# Altium project Modular Parent Motherboard.PrjPcb
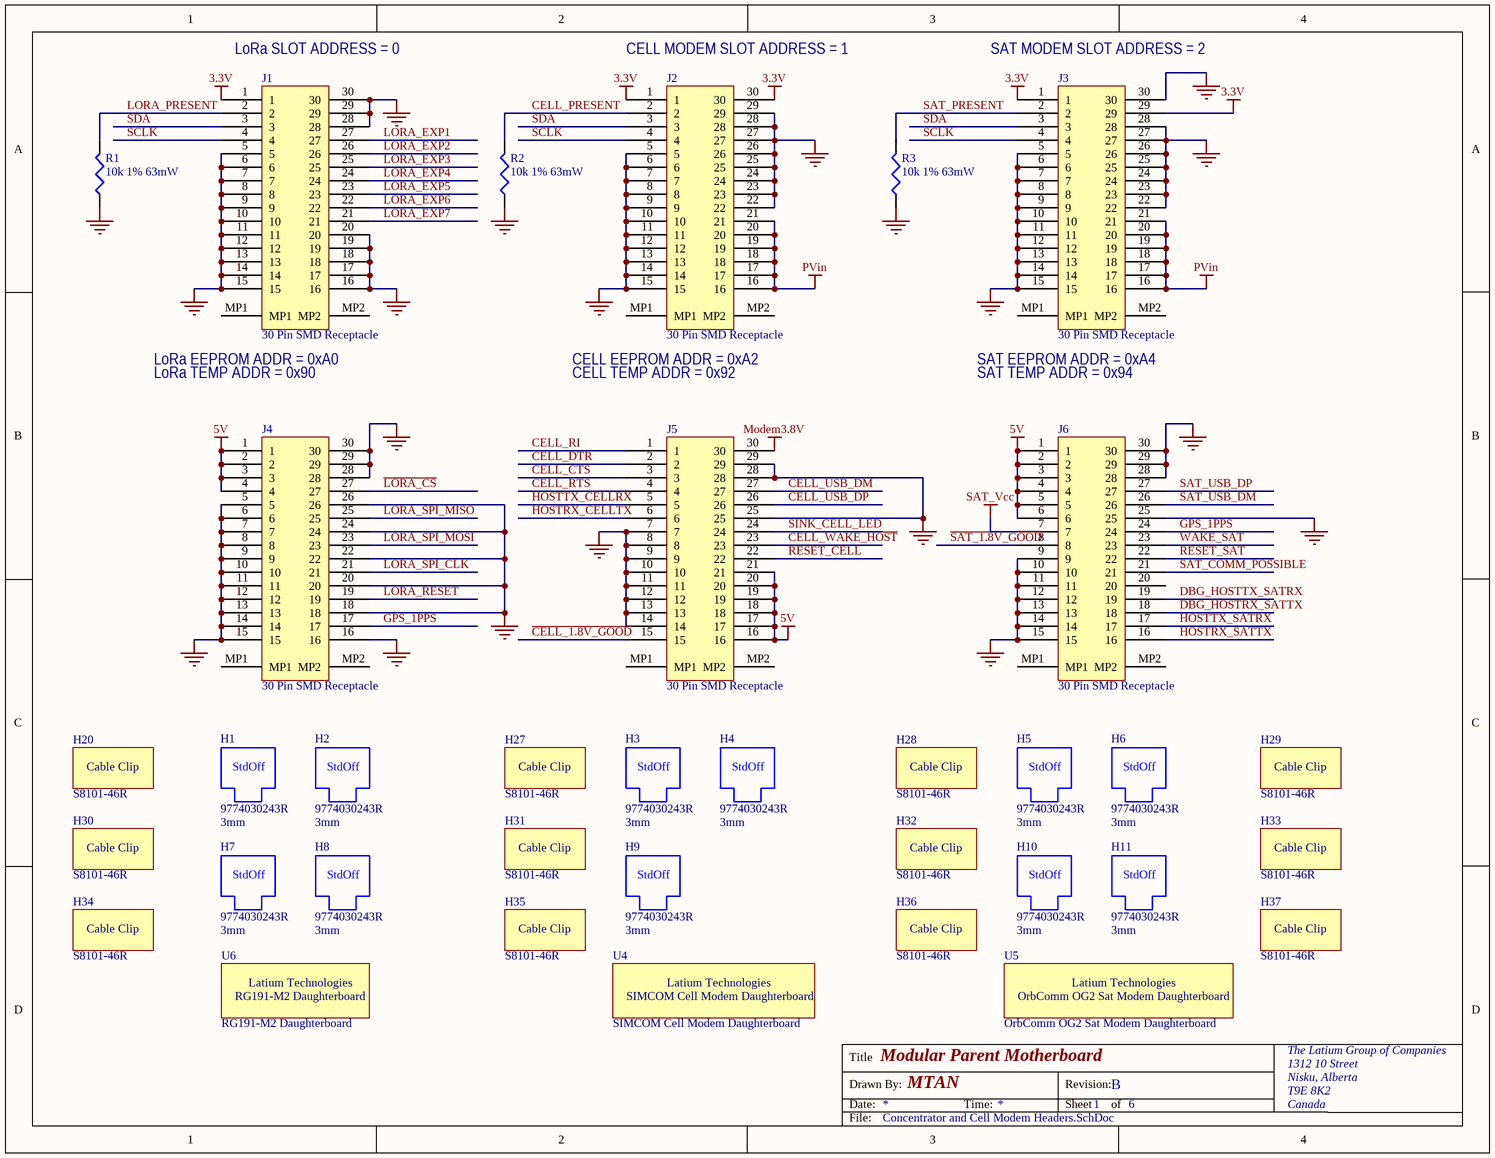
[diagram p0: Concentrator and Cell Modem Headers.SchDoc]
6 sheets, 150 parts. Net scope: global (net labels, ports and power ports of the same name join across sheets).
Board file: Modular Parent Motherboard.PcbDoc
Sheets:
  Concentrator and Cell Modem Headers.SchDoc
  Expansion Headers.SchDoc
  Slot Pullups and Pulldowns.SchDoc
  Power Supply and LEDs.SchDoc
  Controller Headers.SchDoc
  Controller Watchdog.SchDoc

## Sheet Concentrator and Cell Modem Headers.SchDoc: Modular Parent Motherboard
size Letter; DrawnBy: MTAN; Organization: Altium Limited; DocumentNumber: 1; Revision: B; SheetNumber: 1; SheetTotal: 6

### Parts
H1  9774030243R  Height: 3mm  [Wurth 9774030243R]
H2  9774030243R  Height: 3mm  [Wurth 9774030243R]
H3  9774030243R  Height: 3mm  [Wurth 9774030243R]
H4  9774030243R  Height: 3mm  [Wurth 9774030243R]
H5  9774030243R  Height: 3mm  [Wurth 9774030243R]
H6  9774030243R  Height: 3mm  [Wurth 9774030243R]
H7  9774030243R  Height: 3mm  [Wurth 9774030243R]
H8  9774030243R  Height: 3mm  [Wurth 9774030243R]
H9  9774030243R  Height: 3mm  [Wurth 9774030243R]
H10  9774030243R  Height: 3mm  [Wurth 9774030243R]
H11  9774030243R  Height: 3mm  [Wurth 9774030243R]
H20  S8101-46R  [Coax Cable Clip]
H27  S8101-46R  [Coax Cable Clip]
H28  S8101-46R  [Coax Cable Clip]
H29  S8101-46R  [Coax Cable Clip]
H30  S8101-46R  [Coax Cable Clip]
H31  S8101-46R  [Coax Cable Clip]
H32  S8101-46R  [Coax Cable Clip]
H33  S8101-46R  [Coax Cable Clip]
H34  S8101-46R  [Coax Cable Clip]
H35  S8101-46R  [Coax Cable Clip]
H36  S8101-46R  [Coax Cable Clip]
H37  S8101-46R  [Coax Cable Clip]
J1  30 Pin SMD Receptacle  [10132798-031100LF]
J2  30 Pin SMD Receptacle  [10132798-031100LF]
J3  30 Pin SMD Receptacle  [10132798-031100LF]
J4  30 Pin SMD Receptacle  [10132798-031100LF]
J5  30 Pin SMD Receptacle  [10132798-031100LF]
J6  30 Pin SMD Receptacle  [10132798-031100LF]
R1  10k 1% 63mW  [RESC1005L]
R2  10k 1% 63mW  [RESC1005L]
R3  10k 1% 63mW  [RESC1005L]
U4  SIMCOM Cell Modem Daughterboard  [SIMCOM Cell Modem Daughterboard]  (no BOM)
U5  OrbComm OG2 Sat Modem Daughterboard  [OrbComm OG2 Daughterboard]  (no BOM)
U6  RG191-M2 Daughterboard  [RG191-M2 LoRa Daughterboard]  (no BOM)

### Nets
3.3V: J1.1 J2.1 J2.30 J3.1 J3.29
5V: J4.1 J4.2 J4.3 J4.4 J5.16 J5.17 J5.18 J5.19 J5.20 J5.21 J6.1 J6.2 J6.3 J6.4 J6.5 J6.6
GND: J1.5 J1.6 J1.7 J1.8 J1.9 J1.10 J1.11 J1.12 J1.13 J1.14 J1.15 J1.16 J1.17 J1.18 J1.19 J1.20 J1.28 J1.29 J1.30 J2.5 J2.6 J2.7 J2.8 J2.9 J2.10 J2.11 J2.12 J2.13 J2.14 J2.15 J2.22 J2.23 J2.24 J2.25 J2.26 J2.27 J2.28 J2.29 J3.5 J3.6 J3.7 J3.8 J3.9 J3.10 J3.11 J3.12 J3.13 J3.14 J3.15 J3.22 J3.23 J3.24 J3.25 J3.26 J3.27 J3.28 J3.30 J4.5 J4.6 J4.7 J4.8 J4.9 J4.10 J4.11 J4.12 J4.13 J4.14 J4.15 J4.16 J4.18 J4.20 J4.22 J4.24 J4.26 J4.28 J4.29 J4.30 J5.7 J5.8 J5.9 J5.10 J5.11 J5.12 J5.13 J5.14 J5.25 J5.28 J5.29 J6.9 J6.10 J6.11 J6.12 J6.13 J6.14 J6.15 J6.25 J6.28 J6.29 J6.30 R1.1 R2.1 R3.1
Modem3.8V: J5.30
PVin: J2.16 J2.17 J2.18 J2.19 J2.20 J2.21 J3.16 J3.17 J3.18 J3.19 J3.20 J3.21
SAT_Vcc: J6.7
~{CELL_1.8V_GOOD}: J5.15
~{CELL_WAKE_HOST}: J5.23
CELL_CTS: J5.3
CELL_DTR: J5.2
CELL_PRESENT: J2.2 R2.2
CELL_RI: J5.1
CELL_RTS: J5.4
CELL_USB_DM: J5.27
CELL_USB_DP: J5.26
DBG_HOSTRX_SATTX: J6.18
DBG_HOSTTX_SATRX: J6.19
GPS_1PPS: J4.17 J6.24
HOSTRX_CELLTX: J5.6
HOSTRX_SATTX: J6.16
HOSTTX_CELLRX: J5.5
HOSTTX_SATRX: J6.17
~{LORA_CS}: J4.27
LORA_EXP1: J1.27
LORA_EXP2: J1.26
LORA_EXP3: J1.25
LORA_EXP4: J1.24
LORA_EXP5: J1.23
LORA_EXP6: J1.22
LORA_EXP7: J1.21
LORA_PRESENT: J1.2 R1.2
LORA_RESET: J4.19
LORA_SPI_CLK: J4.21
LORA_SPI_MISO: J4.25
LORA_SPI_MOSI: J4.23
RESET_CELL: J5.22
RESET_SAT: J6.22
~{SAT_1.8V_GOOD}: J6.8
~{SINK_CELL_LED}: J5.24
SAT_COMM_POSSIBLE: J6.21
SAT_PRESENT: J3.2 R3.2
SAT_USB_DM: J6.26
SAT_USB_DP: J6.27
SCLK: J1.4 J2.4 J3.4
SDA: J1.3 J2.3 J3.3
WAKE_SAT: J6.23

Not connected (* = marked no-connect by the designer): J1 MP1 MP2; J2 MP1 MP2; J3 MP1 MP2; J4 MP1 MP2; J5 MP1 MP2; J6 20 MP1 MP2

### Notes on the sheet
- (near J1) LoRa SLOT ADDRESS = 0
- (near J2) CELL MODEM SLOT ADDRESS = 1
- (near J3) SAT MODEM SLOT ADDRESS = 2
- (near J1) LoRa EEPROM ADDR = 0xA0
- (near J2) CELL EEPROM ADDR = 0xA2
- (near J3) SAT EEPROM ADDR = 0xA4
- LoRa TEMP ADDR = 0x90
- CELL TEMP ADDR = 0x92
- SAT TEMP ADDR = 0x94
- Title
- Drawn By:
- Date:
- Time:
- Revision:
- Sheet
- of
- The Latium Group of Companies
- 1312 10 Street
- Nisku, Alberta
- T9E 8K2
- Canada
- File:
- (in symbol OrbComm OG2 Sat Modem Daughterboard) Latium Technologies
- (in symbol RG191-M2 Daughterboard) Latium Technologies
- (in symbol SIMCOM Cell Modem Daughterboard) Latium Technologies
- (in symbol SMD M3 Spacer) StdOff

### Library data of the parts
H1-H11 = SMD M3 Spacer: ROUND STANDOFF M2X0.4 STEEL 3MM; Manufacturer: Wurth Electronics Inc; Supplier 1: Digi-Key; Value: 9774030243R; Manufacturer Part Number: 9774030243R; ComponentLink1Description: Drawing; ComponentLink1URL: S:\Hardware\Data Sheets\Passive\Standoffs\Wurth 9774070360R.pdf; Supplier 1 Part Number: 732-7085-1-ND
H20 H27-H37 = Cable Clip: CBL CLIP C-TYPE SILVER SOLDER; Manufacturer: Harwin Inc; Value: S8101-46R; ComponentLink1Description: Drawing; ComponentLink1URL: S:\Hardware\Data Sheets\Passive\Strain Reliefs\S8101R.pdf; Manufacturer Part Number: S8101-46R; Supplier 1: Digi-Key; Supplier 1 Part Number: 952-1576-1-ND
J1-J6 = Amphenol 30 Pos BergStak Plug: CONN RCPT 30POS SMD GOLD; Manufacturer: Amphenol ICC (FCI); Note: Mates with 10132797-031100LF plug 3mm between board height; Value: 30 Pin SMD Receptacle; Manufacturer Part Number: 10132798-031100LF; Supplier 1: Digi-Key; Supplier 1 Part Number: 609-5030-1-ND
R1-R3 = Res3: Resistor; Value: 10k 1% 63mW
U4 = SIMCOM Cell Modem Daughterboard: Value: SIMCOM Cell Modem Daughterboard
U5 = OrbComm OG2 Sat Modem Daughterboard: Value: OrbComm OG2 Sat Modem Daughterboard
U6 = RG191-M2 Daughterboard: Value: RG191-M2 Daughterboard

## Sheet Expansion Headers.SchDoc: Modular Parent Motherboard
size Letter; DrawnBy: MTAN; Organization: Altium Limited; DocumentNumber: 2; Revision: B; SheetNumber: 2; SheetTotal: 6
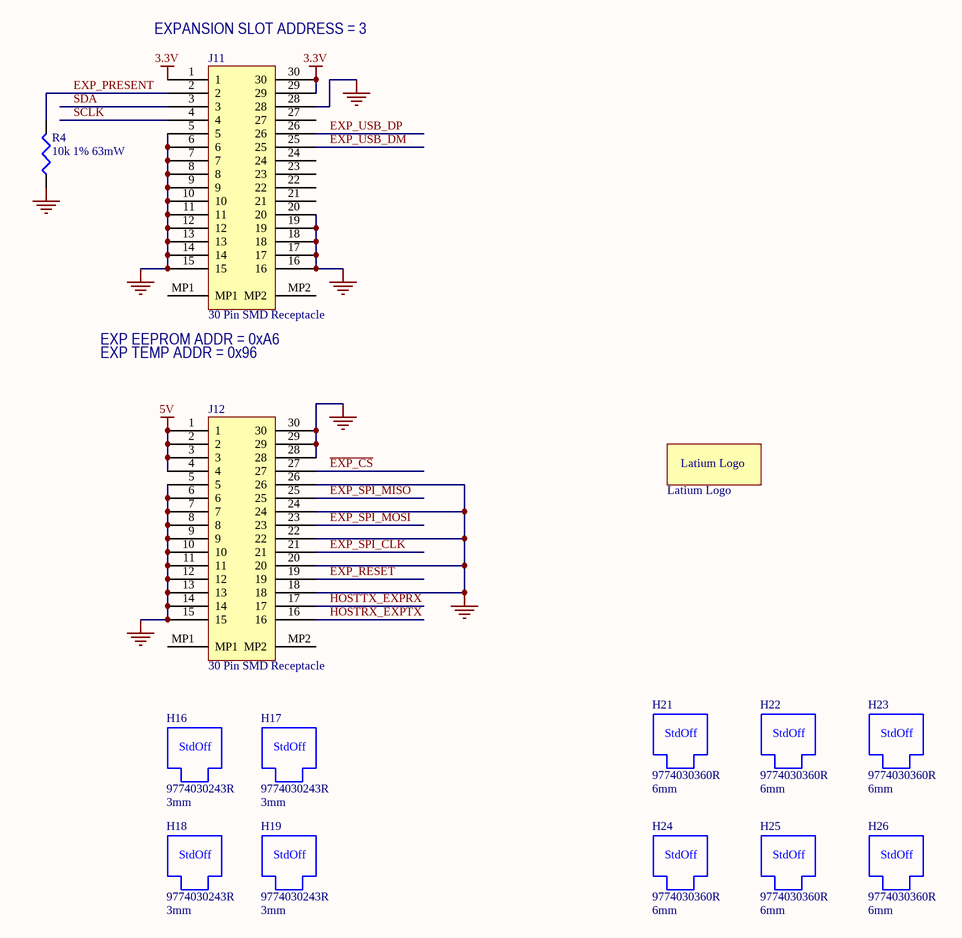
[diagram p1: Expansion Headers.SchDoc]

### Parts
H16  9774030243R  Height: 3mm  [Wurth 9774030243R]
H17  9774030243R  Height: 3mm  [Wurth 9774030243R]
H18  9774030243R  Height: 3mm  [Wurth 9774030243R]
H19  9774030243R  Height: 3mm  [Wurth 9774030243R]
H21  9774030360R  Height: 6mm  [Wurth 9774060360R]
H22  9774030360R  Height: 6mm  [Wurth 9774060360R]
H23  9774030360R  Height: 6mm  [Wurth 9774060360R]
H24  9774030360R  Height: 6mm  [Wurth 9774060360R]
H25  9774030360R  Height: 6mm  [Wurth 9774060360R]
H26  9774030360R  Height: 6mm  [Wurth 9774060360R]
H38  Latium Logo  [LatiumLogo]  (no BOM)
J11  30 Pin SMD Receptacle  [10132798-031100LF]
J12  30 Pin SMD Receptacle  [10132798-031100LF]
R4  10k 1% 63mW  [RESC1005L]

### Nets
3.3V: J11.1 J11.29 J11.30
5V: J12.1 J12.2 J12.3 J12.4
GND: J11.5 J11.6 J11.7 J11.8 J11.9 J11.10 J11.11 J11.12 J11.13 J11.14 J11.15 J11.16 J11.17 J11.18 J11.19 J11.20 J11.28 J12.5 J12.6 J12.7 J12.8 J12.9 J12.10 J12.11 J12.12 J12.13 J12.14 J12.15 J12.18 J12.20 J12.22 J12.24 J12.26 J12.28 J12.29 J12.30 R4.1
~{EXP_CS}: J12.27
EXP_PRESENT: J11.2 R4.2
EXP_RESET: J12.19
EXP_SPI_CLK: J12.21
EXP_SPI_MISO: J12.25
EXP_SPI_MOSI: J12.23
EXP_USB_DM: J11.25
EXP_USB_DP: J11.26
HOSTRX_EXPTX: J12.16
HOSTTX_EXPRX: J12.17
SCLK: J11.4
SDA: J11.3

Not connected (* = marked no-connect by the designer): J11 21 22 23 24 27 MP1 MP2; J12 MP1 MP2

### Notes on the sheet
- (near J11) EXPANSION SLOT ADDRESS = 3
- (near J11) EXP EEPROM ADDR = 0xA6
- EXP TEMP ADDR = 0x96
- Title
- Drawn By:
- Date:
- Time:
- Revision:
- Sheet
- of
- The Latium Group of Companies
- 1312 10 Street
- Nisku, Alberta
- T9E 8K2
- Canada
- File:
- (in symbol SMD M3 Spacer) StdOff

### Library data of the parts
H16-H19 = SMD M3 Spacer: as H1 on sheet Concentrator and Cell Modem Headers; Supplier 1: Digi-Key; Value: 9774030243R; Manufacturer Part Number: 9774030243R; ComponentLink1Description: Drawing; ComponentLink1URL: S:\Hardware\Data Sheets\Passive\Standoffs\Wurth 9774070360R.pdf; Supplier 1 Part Number: 732-7085-1-ND
H21-H26 = SMD M3 Spacer: ROUND STANDOFF M3X0.5 STEEL 6MM; Manufacturer: Wurth Electronics Inc; Manufacturer Part Number: 9774060360R; Supplier 1: Digi-Key; Value: 9774030360R; ComponentLink1Description: Drawing; ComponentLink1URL: S:\Hardware\Data Sheets\Passive\Spacers\Wurth 9774060360R.pdf; Supplier 1 Part Number: 732-5273-1-ND
J11 J12 = Amphenol 30 Pos BergStak Plug: as J1 on sheet Concentrator and Cell Modem Headers; Value: 30 Pin SMD Receptacle; Manufacturer Part Number: 10132798-031100LF; Supplier 1: Digi-Key; Supplier 1 Part Number: 609-5030-1-ND
R4 = Res3: Resistor; Value: 10k 1% 63mW
H38 = Latium Logo: Value: Latium Logo

## Sheet Slot Pullups and Pulldowns.SchDoc: Modular Parent Motherboard
size Letter; DrawnBy: MTAN; Organization: Altium Limited; DocumentNumber: 3; Revision: B; SheetNumber: 3; SheetTotal: 6
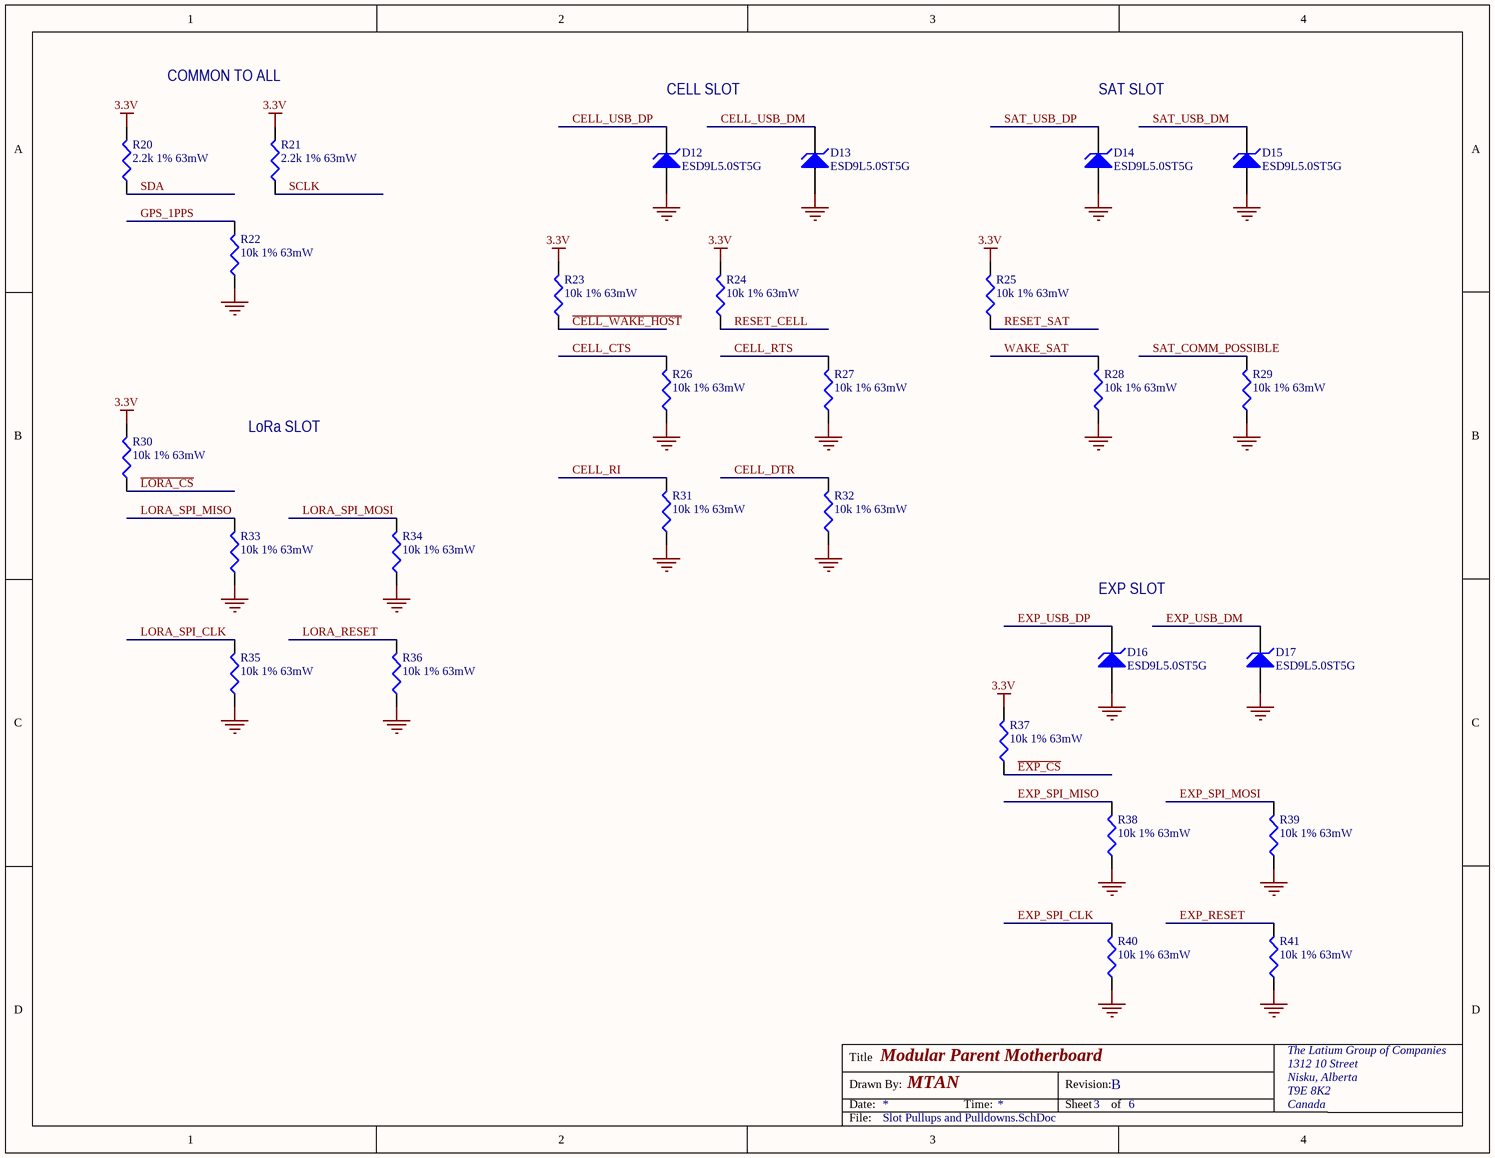
[diagram p2: Slot Pullups and Pulldowns.SchDoc]

### Parts
D12  ESD9L5.0ST5G  [SOD-923]
D13  ESD9L5.0ST5G  [SOD-923]
D14  ESD9L5.0ST5G  [SOD-923]
D15  ESD9L5.0ST5G  [SOD-923]
D16  ESD9L5.0ST5G  [SOD-923]
D17  ESD9L5.0ST5G  [SOD-923]
R20  2.2k 1% 63mW  [RESC1005L]
R21  2.2k 1% 63mW  [RESC1005L]
R22  10k 1% 63mW  [RESC1005L]
R23  10k 1% 63mW  [RESC1005L]
R24  10k 1% 63mW  [RESC1005L]
R25  10k 1% 63mW  [RESC1005L]
R26  10k 1% 63mW  [RESC1005L]
R27  10k 1% 63mW  [RESC1005L]
R28  10k 1% 63mW  [RESC1005L]
R29  10k 1% 63mW  [RESC1005L]
R30  10k 1% 63mW  [RESC1005L]
R31  10k 1% 63mW  [RESC1005L]
R32  10k 1% 63mW  [RESC1005L]
R33  10k 1% 63mW  [RESC1005L]
R34  10k 1% 63mW  [RESC1005L]
R35  10k 1% 63mW  [RESC1005L]
R36  10k 1% 63mW  [RESC1005L]
R37  10k 1% 63mW  [RESC1005L]
R38  10k 1% 63mW  [RESC1005L]
R39  10k 1% 63mW  [RESC1005L]
R40  10k 1% 63mW  [RESC1005L]
R41  10k 1% 63mW  [RESC1005L]

### Nets
3.3V: R20.2 R21.2 R23.2 R24.2 R25.2 R30.2 R37.2
GND: D12.1(A) D13.1(A) D14.1(A) D15.1(A) D16.1(A) D17.1(A) R22.1 R26.1 R27.1 R28.1 R29.1 R31.1 R32.1 R33.1 R34.1 R35.1 R36.1 R38.1 R39.1 R40.1 R41.1
~{CELL_WAKE_HOST}: R23.1
CELL_CTS: R26.2
CELL_DTR: R32.2
CELL_RI: R31.2
CELL_RTS: R27.2
CELL_USB_DM: D13.2(K)
CELL_USB_DP: D12.2(K)
~{EXP_CS}: R37.1
EXP_RESET: R41.2
EXP_SPI_CLK: R40.2
EXP_SPI_MISO: R38.2
EXP_SPI_MOSI: R39.2
EXP_USB_DM: D17.2(K)
EXP_USB_DP: D16.2(K)
GPS_1PPS: R22.2
~{LORA_CS}: R30.1
LORA_RESET: R36.2
LORA_SPI_CLK: R35.2
LORA_SPI_MISO: R33.2
LORA_SPI_MOSI: R34.2
RESET_CELL: R24.1
RESET_SAT: R25.1
SAT_COMM_POSSIBLE: R29.2
SAT_USB_DM: D15.2(K)
SAT_USB_DP: D14.2(K)
SCLK: R21.1
SDA: R20.1
WAKE_SAT: R28.2

### Notes on the sheet
- COMMON TO ALL
- CELL SLOT
- SAT SLOT
- LoRa SLOT
- EXP SLOT
- Title
- Drawn By:
- Date:
- Time:
- Revision:
- Sheet
- of
- The Latium Group of Companies
- 1312 10 Street
- Nisku, Alberta
- T9E 8K2
- Canada
- File:

### Library data of the parts
D12-D17 = D Zener: TVS DIODE 5V 9.8V SOD923; Manufacturer: ON Semiconductor; Value: ESD9L5.0ST5G; Manufacturer Part Number: ESD9L5.0ST5G; Supplier 1: Digi-Key; Supplier 1 Part Number: ESD9L5.0ST5GOSCT-ND
R20-R41 = Res3: Resistor
  R20 R21: Value: 2.2k 1% 63mW
  R22-R41: Value: 10k 1% 63mW

## Sheet Power Supply and LEDs.SchDoc: Modular Parent Motherboard
size Letter; DrawnBy: MTAN; Organization: Altium Limited; DocumentNumber: 4; Revision: B; SheetNumber: 4; SheetTotal: 6
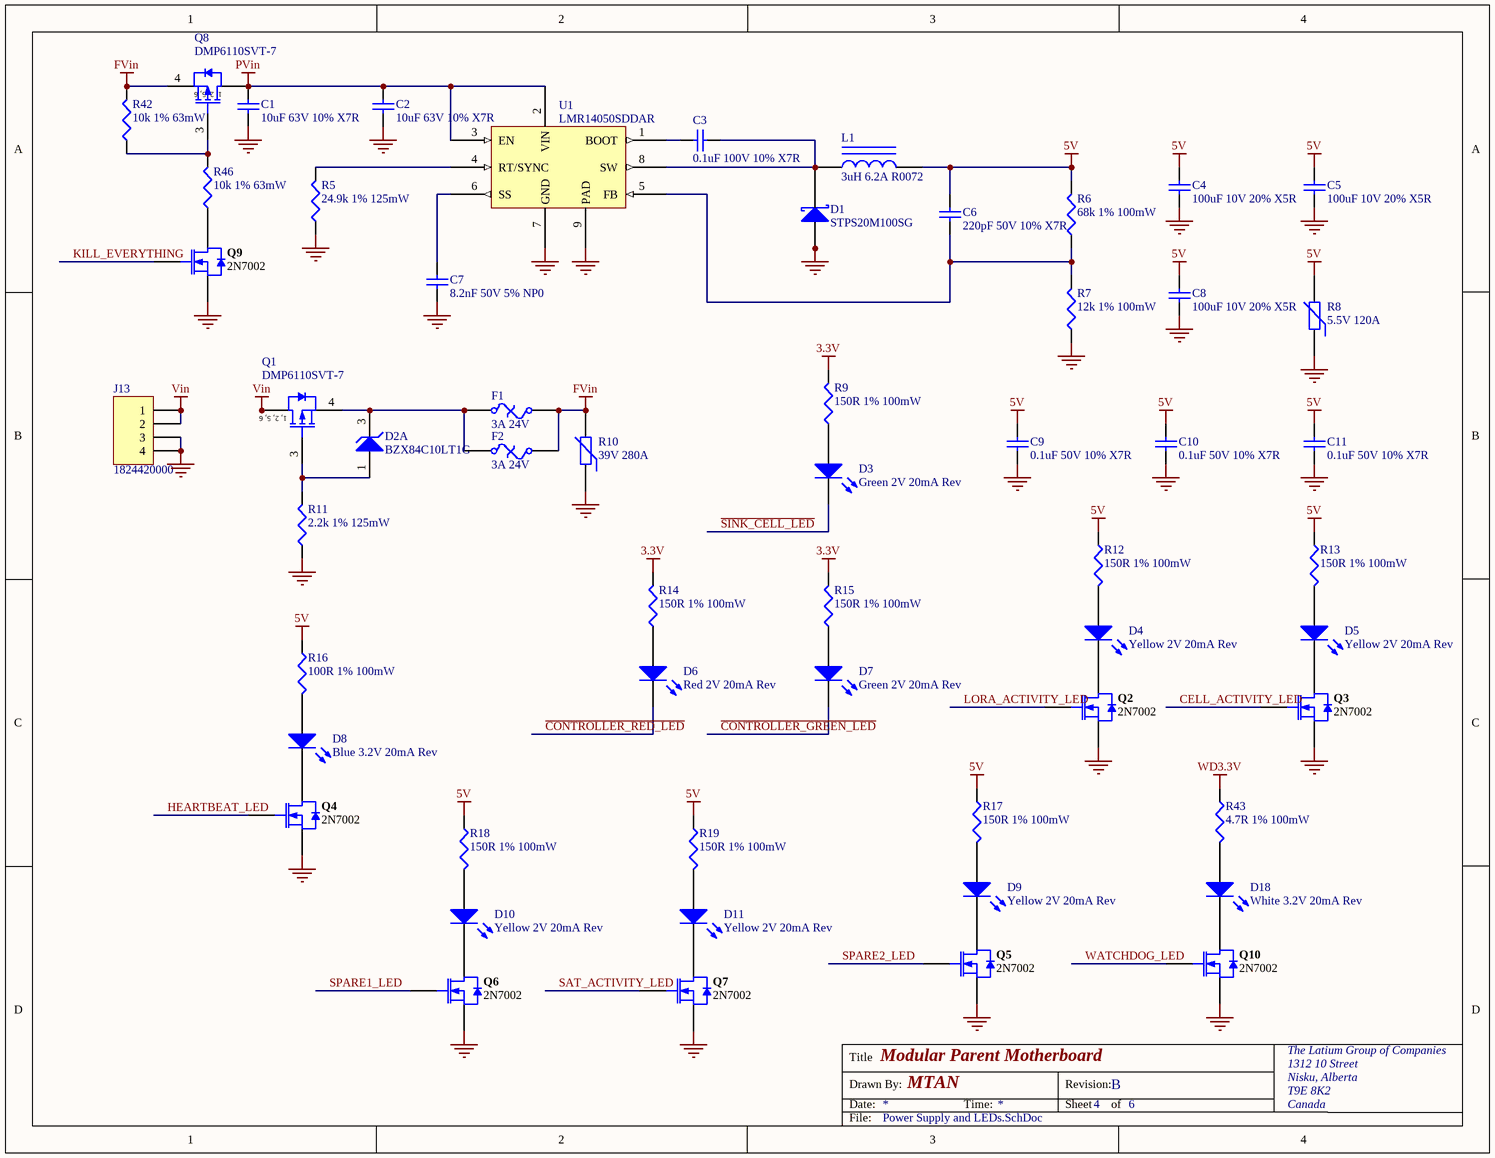
[diagram p3: Power Supply and LEDs.SchDoc]

### Parts
C1  10uF 63V 10% X7R  [C1210_L]
C2  10uF 63V 10% X7R  [C1210_L]
C3  0.1uF 100V 10% X7R  [C0805]
C4  100uF 10V 20% X5R  [C1210_L]
C5  100uF 10V 20% X5R  [C1210_L]
C6  220pF 50V 10% X7R  [1608[0603]]
C7  8.2nF 50V 5% NP0  [1608[0603]]
C8  100uF 10V 20% X5R  [C1210_L]
C9  0.1uF 50V 10% X7R  [CAPC1005L]
C10  0.1uF 50V 10% X7R  [CAPC1005L]
C11  0.1uF 50V 10% X7R  [CAPC1005L]
D1  STPS20M100SG  [ONSC-D2PAK-3-418AJ_A_V]
D2  BZX84C10LT1G  [SOT23-3_L]  (part A of 2)
D3  Green 2V 20mA Rev  [1206 Reverse LED]
D4  Yellow 2V 20mA Rev  [1206 Reverse LED]
D5  Yellow 2V 20mA Rev  [1206 Reverse LED]
D6  Red 2V 20mA Rev  [1206 Reverse LED]
D7  Green 2V 20mA Rev  [1206 Reverse LED]
D8  Blue 3.2V 20mA Rev  [1206 Reverse LED]
D9  Yellow 2V 20mA Rev  [1206 Reverse LED]
D10  Yellow 2V 20mA Rev  [1206 Reverse LED]
D11  Yellow 2V 20mA Rev  [1206 Reverse LED]
D18  White 3.2V 20mA Rev  [1206 Reverse LED]
F1  3A 24V  [2920]
F2  3A 24V  [2920]
J13  1824420000  [1824420000]
L1  3uH 6.2A R0072  [SRU1048]
Q1  DMP6110SVT-7  [SOT23-6_L]
Q2  2N7002  [INF-PG-SOT23_L]
Q3  2N7002  [INF-PG-SOT23_L]
Q4  2N7002  [INF-PG-SOT23_L]
Q5  2N7002  [INF-PG-SOT23_L]
Q6  2N7002  [INF-PG-SOT23_L]
Q7  2N7002  [INF-PG-SOT23_L]
Q8  DMP6110SVT-7  [SOT23-6_L]
Q9  2N7002  [INF-PG-SOT23_L]
Q10  2N7002  [INF-PG-SOT23_L]
R5  24.9k 1% 125mW  [6-0805_L]
R6  68k 1% 100mW  [J1-0603]
R7  12k 1% 100mW  [J1-0603]
R8  5.5V 120A  [6-0805_L]
R9  150R 1% 100mW  [RESC1608L]
R10  39V 280A  [RESC3225L]
R11  2.2k 1% 125mW  [6-0805_L]
R12  150R 1% 100mW  [RESC1608L]
R13  150R 1% 100mW  [RESC1608L]
R14  150R 1% 100mW  [RESC1608L]
R15  150R 1% 100mW  [RESC1608L]
R16  100R 1% 100mW  [RESC1608L]
R17  150R 1% 100mW  [RESC1608L]
R18  150R 1% 100mW  [RESC1608L]
R19  150R 1% 100mW  [RESC1608L]
R42  10k 1% 63mW  [RESC1005L]
R43  4.7R 1% 100mW  [RESC1608L]
R46  10k 1% 63mW  [RESC1005L]
U1  LMR14050SDDAR  [MRA08A_L]

### Nets
3.3V: R9.2 R14.2 R15.2
5V: C4.2 C5.2 C6.2 C8.2 C9.1 C10.1 C11.1 L1.2 R6.2 R8.2 R12.1 R13.1 R16.1 R17.1 R18.1 R19.1
FVin: F1.2 F2.2 Q8.4(S) R10.2 R42.2
GND: C1.1 C2.1 C4.1 C5.1 C7.1 C8.1 C9.2 C10.2 C11.2 D1.1(A) D1.3(A) J13.3 J13.4 Q2.2(SOURCE) Q3.2(SOURCE) Q4.2(SOURCE) Q5.2(SOURCE) Q6.2(SOURCE) Q7.2(SOURCE) Q9.2(SOURCE) Q10.2(SOURCE) R5.1 R7.1 R8.1 R10.1 R11.1 U1.7(GND) U1.9(PAD)
PVin: C1.2 C2.2 Q8.1(D) Q8.2(D) Q8.5(D) Q8.6(D) U1.2(VIN) U1.3(EN)
Vin: J13.1 J13.2 Q1.1(D) Q1.2(D) Q1.5(D) Q1.6(D)
WD3.3V: R43.1
~{CONTROLLER_GREEN_LED}: D7.2(K)
~{CONTROLLER_RED_LED}: D6.2(K)
CELL_ACTIVITY_LED: Q3.1(GATE)
HEARTBEAT_LED: Q4.1(GATE)
KILL_EVERYTHING: Q9.1(GATE)
LORA_ACTIVITY_LED: Q2.1(GATE)
~{SINK_CELL_LED}: D3.2(K)
SAT_ACTIVITY_LED: Q7.1(GATE)
SPARE1_LED: Q6.1(GATE)
SPARE2_LED: Q5.1(GATE)
WATCHDOG_LED: Q10.1(GATE)
NetC3_1: C3.1 D1.4(K) L1.1 U1.8(SW)
NetC3_2: C3.2 U1.1(BOOT)
NetC6_1: C6.1 R6.1 R7.2 U1.5(FB)
NetC7_2: C7.2 U1.6(SS)
NetD2_1: D2.1(A) Q1.3(G) R11.2
NetD2_3: D2.3(K) F1.1 F2.1 Q1.4(S)
NetD3_1: D3.1(A) R9.1
NetD4_1: D4.1(A) R12.2
NetD4_2: D4.2(K) Q2.3(DRAIN)
NetD5_1: D5.1(A) R13.2
NetD5_2: D5.2(K) Q3.3(DRAIN)
NetD6_1: D6.1(A) R14.1
NetD7_1: D7.1(A) R15.1
NetD8_1: D8.1(A) R16.2
NetD8_2: D8.2(K) Q4.3(DRAIN)
NetD9_1: D9.1(A) R17.2
NetD9_2: D9.2(K) Q5.3(DRAIN)
NetD10_1: D10.1(A) R18.2
NetD10_2: D10.2(K) Q6.3(DRAIN)
NetD11_1: D11.1(A) R19.2
NetD11_2: D11.2(K) Q7.3(DRAIN)
NetD18_1: D18.1(A) R43.2
NetD18_2: D18.2(K) Q10.3(DRAIN)
NetQ8_3: Q8.3(G) R42.1 R46.2
NetQ9_3: Q9.3(DRAIN) R46.1
NetR5_2: R5.2 U1.4(RT/SYNC)

### Notes on the sheet
- Title
- Drawn By:
- Date:
- Time:
- Revision:
- Sheet
- of
- The Latium Group of Companies
- 1312 10 Street
- Nisku, Alberta
- T9E 8K2
- Canada
- File:
- (in symbol NTGS3136PT1G) 1, 2, 5, 6

### Library data of the parts
C1-C11 = Cap: Capacitor
  C1 C2: Value: 10uF 63V 10% X7R
  C3: Value: 0.1uF 100V 10% X7R
  C4 C5 C8: Value: 100uF 10V 20% X5R
  C6: Value: 220pF 50V 10% X7R
  C7: Value: 8.2nF 50V 5% NP0
  C9-C11: Value: 0.1uF 50V 10% X7R
D1 = BAS70: DIODE SCHOTTKY 100V 20A D2PAK; Manufacturer: STMicroelectronics; ComponentLink2Description: Datasheet; ComponentLink2URL: S:\Hardware\Data Sheets\Passive\Diodes\STPS20M100.pdf; Value: STPS20M100SG; Manufacturer Part Number: STPS20M100SG; Supplier 1: Digi-Key; Supplier 1 Part Number: 497-10993-1-ND
D2 = BZX84C10LT1G: DIODE ZENER 10V 225MW SOT23-3; Manufacturer: On Semiconductor; Supplier 1: Digi-Key; Supplier 1 Part Number: BZX84C10LT1GOSCT-ND; ComponentLink1Description: Data Sheet; ComponentLink1URL: S:\Hardware\Data Sheets\Passive\Diodes\BZX84C2V4LT1-D.pdf; Value: BZX84C10LT1G; Manufacturer Part Number: BZX84C10LT1G
D3 D7 = LED2: LED GRN CLEAR 2SMD BOTTOM ENTRY; Manufacturer: Wurth Electronics Inc; Manufacturer Part Number: 156120VS82500; Value: Green 2V 20mA Rev; Supplier 1: Digi-Key; Supplier 1 Part Number: 732-11424-1-ND
D4 D5 D9-D11 = LED2: LED YELLOW CLEAR 2SMD; Manufacturer: Wurth Electronics Inc; Manufacturer Part Number: 156120YS82500; Value: Yellow 2V 20mA Rev; Supplier 1: Digi-Key; Supplier 1 Part Number: 732-11425-1-ND
D6 = LED2: LED RED CLEAR 2SMD BOTTOM ENTRY; Manufacturer: Wurth Electronics Inc; Manufacturer Part Number: 156120RS82500; Value: Red 2V 20mA Rev; Supplier 1: Digi-Key; Supplier 1 Part Number: 732-11422-1-ND
D8 = LED2: LED BLUE CLEAR 2SMD BOTTOM ENTRY; Manufacturer: Wurth Electronics Inc; Manufacturer Part Number: 156120BS82500; Value: Blue 3.2V 20mA Rev; Supplier 1: Digi-Key; Supplier 1 Part Number: 732-11420-1-ND
D18 = LED2: LED WHITE CLEAR 1204 SMD; Manufacturer: Inolux; Manufacturer Part Number: IN-S124BRUW; Value: White 3.2V 20mA Rev; Supplier 1: Digi-Key; Supplier 1 Part Number: 1830-1126-1-ND
F1 F2 = Fuse Thermal: Thermal Fuse; Manufacturer Part Number: SMDC300F/24-2; Manufacturer: Littelfuse Inc; Value: 3A 24V; Supplier 1: Digi-Key; Supplier 1 Part Number: SMDC300F/24-2CT-ND
J13 = Header 4H: TERM BLK 2POS SIDE ENT 3.5MM PCB; Manufacturer: Weidmuller; Value: 1824420000; Manufacturer Part Number: 1824420000; Supplier 1: Digi-Key; Supplier 1 Part Number: 281-2020-ND
L1 = Inductor Iron: FIXED IND 3UH 6.2A 7.2 MOHM SMD; Manufacturer Part Number: SRU1048-3R0Y; Manufacturer: Bourns Inc; Value: 3uH 6.2A R0072; Supplier 1: Digi-Key; Supplier 1 Part Number: SRU1048-3R0YCT-ND; ComponentLink1Description: Data Sheet; ComponentLink1URL: S:\Hardware\Data Sheets\Passive\Inductors\SRU1048.pdf
Q1 Q8 = NTGS3136PT1G: MOSFET P-CH 60V TSOT26; Manufacturer: Diodes Incorporated; ComponentLink1Description: Data Sheet; ComponentLink1URL: S:\Hardware\Data Sheets\Passive\FETs\DMP6110SVT.pdf; Value: DMP6110SVT-7; Manufacturer Part Number: DMP6110SVT-7; Supplier 1: Digi-Key; Supplier 1 Part Number: DMP6110SVT-7DICT-ND
Q2-Q7 Q9 Q10 = 2N7002: MOSFET N-CH 60V 115MA SOT-23; Manufacturer: ON Semiconductor; ComponentLink1Description: Data Sheet; ComponentLink1URL: S:\Hardware\Data Sheets\Active\Transistors\FETs\NDS7002A-D.pdf; Manufacturer Part Number: 2N7002; Value: 2N7002; Supplier 1: Digi-Key; Supplier 1 Part Number: 2N7002NCT-ND
R5-R7 R9 R11-R19 R42 R43 R46 = Res3: Resistor
  R5: Value: 24.9k 1% 125mW
  R6: Value: 68k 1% 100mW
  R7: Value: 12k 1% 100mW
  R9 R12-R15 R17-R19: Value: 150R 1% 100mW
  R11: Value: 2.2k 1% 125mW
  R16: Value: 100R 1% 100mW
  R42 R46: Value: 10k 1% 63mW
  R43: Value: 4.7R 1% 100mW
R8 = Res Varistor: VARISTOR 8.2V 120A 0805; Manufacturer: Littelfuse Inc; Manufacturer Part Number: V5.5MLA0805H; Value: 5.5V 120A; Supplier 1: Digi-Key; Supplier 1 Part Number: F2215CT-ND
R10 = Res Varistor: VARISTOR 39V 280A 1210; Manufacturer: Littelfuse Inc; Manufacturer Part Number: V30MLA1210NH; Value: 39V 280A; Supplier 1: Digi-Key; Supplier 1 Part Number: F3825CT-ND
U1 = LMR14050: IC REG BUCK ADJUSTABLE 5A 8SOPWR; Manufacturer: Texas Instruments; Value: LMR14050SDDAR; Manufacturer Part Number: LMR14050SDDAR; Supplier 1: Digi-Key; Supplier 1 Part Number: 296-44322-1-ND; ComponentLink1Description: Data Sheet; ComponentLink1URL: S:\Hardware\Data Sheets\Active\Voltage Regulators\lmr14050.pdf

## Sheet Controller Headers.SchDoc: Modular Parent Motherboard
size Letter; DrawnBy: MTAN; Organization: Altium Limited; DocumentNumber: 5; Revision: B; SheetNumber: 5; SheetTotal: 6
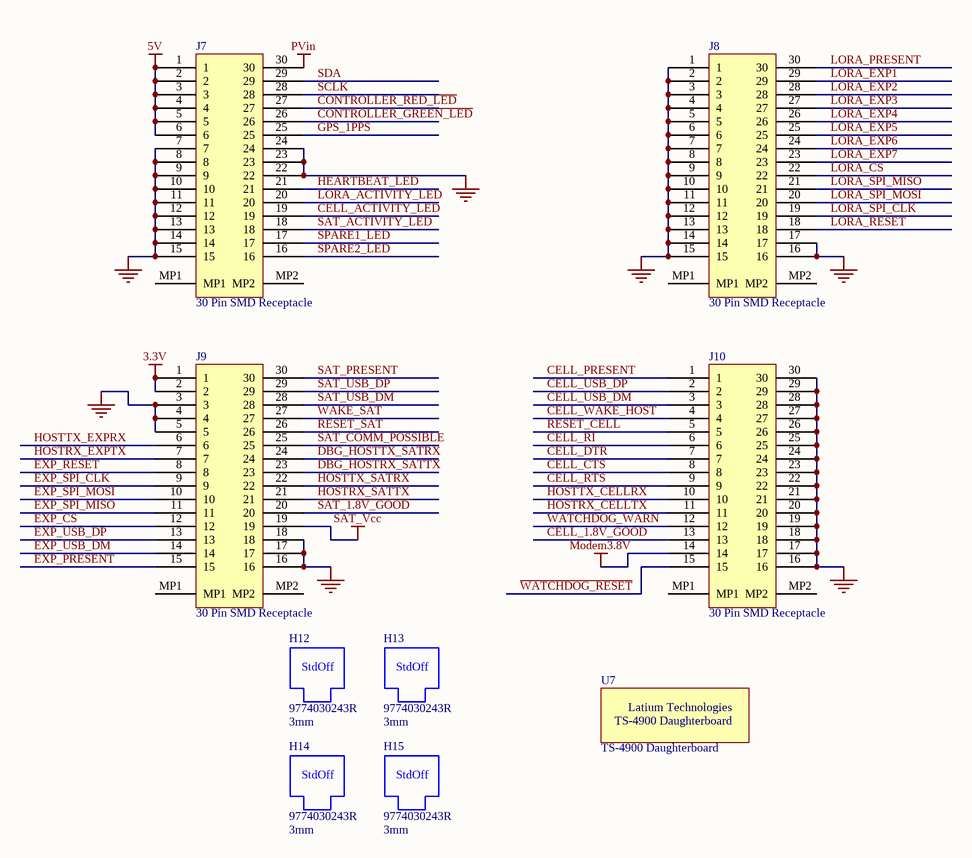
[diagram p4: Controller Headers.SchDoc]

### Parts
H12  9774030243R  Height: 3mm  [Wurth 9774030243R]
H13  9774030243R  Height: 3mm  [Wurth 9774030243R]
H14  9774030243R  Height: 3mm  [Wurth 9774030243R]
H15  9774030243R  Height: 3mm  [Wurth 9774030243R]
J7  30 Pin SMD Receptacle  [10132798-031100LF]
J8  30 Pin SMD Receptacle  [10132798-031100LF]
J9  30 Pin SMD Receptacle  [10132798-031100LF]
J10  30 Pin SMD Receptacle  [10132798-031100LF]
U7  TS-4900 Daughterboard  [TS-4900 Daughterboard]  (no BOM)

### Nets
3.3V: J9.1 J9.2
5V: J7.1 J7.2 J7.3 J7.4 J7.5 J7.6
GND: J7.7 J7.8 J7.9 J7.10 J7.11 J7.12 J7.13 J7.14 J7.15 J7.22 J7.23 J7.24 J8.1 J8.2 J8.3 J8.4 J8.5 J8.6 J8.7 J8.8 J8.9 J8.10 J8.11 J8.12 J8.13 J8.14 J8.15 J8.16 J8.17 J9.3 J9.4 J9.5 J9.16 J9.17 J9.18 J10.16 J10.17 J10.18 J10.19 J10.20 J10.21 J10.22 J10.23 J10.24 J10.25 J10.26 J10.27 J10.28 J10.29 J10.30
Modem3.8V: J10.14
PVin: J7.30
SAT_Vcc: J9.19
~{CELL_1.8V_GOOD}: J10.13
~{CELL_WAKE_HOST}: J10.4
~{CONTROLLER_GREEN_LED}: J7.26
~{CONTROLLER_RED_LED}: J7.27
CELL_ACTIVITY_LED: J7.19
CELL_CTS: J10.8
CELL_DTR: J10.7
CELL_PRESENT: J10.1
CELL_RI: J10.6
CELL_RTS: J10.9
CELL_USB_DM: J10.3
CELL_USB_DP: J10.2
DBG_HOSTRX_SATTX: J9.23
DBG_HOSTTX_SATRX: J9.24
~{EXP_CS}: J9.12
EXP_PRESENT: J9.15
EXP_RESET: J9.8
EXP_SPI_CLK: J9.9
EXP_SPI_MISO: J9.11
EXP_SPI_MOSI: J9.10
EXP_USB_DM: J9.14
EXP_USB_DP: J9.13
GPS_1PPS: J7.25
HEARTBEAT_LED: J7.21
HOSTRX_CELLTX: J10.11
HOSTRX_EXPTX: J9.7
HOSTRX_SATTX: J9.21
HOSTTX_CELLRX: J10.10
HOSTTX_EXPRX: J9.6
HOSTTX_SATRX: J9.22
~{LORA_CS}: J8.22
LORA_ACTIVITY_LED: J7.20
LORA_EXP1: J8.29
LORA_EXP2: J8.28
LORA_EXP3: J8.27
LORA_EXP4: J8.26
LORA_EXP5: J8.25
LORA_EXP6: J8.24
LORA_EXP7: J8.23
LORA_PRESENT: J8.30
LORA_RESET: J8.18
LORA_SPI_CLK: J8.19
LORA_SPI_MISO: J8.21
LORA_SPI_MOSI: J8.20
RESET_CELL: J10.5
RESET_SAT: J9.26
~{SAT_1.8V_GOOD}: J9.20
SAT_ACTIVITY_LED: J7.18
SAT_COMM_POSSIBLE: J9.25
SAT_PRESENT: J9.30
SAT_USB_DM: J9.28
SAT_USB_DP: J9.29
SCLK: J7.28
SDA: J7.29
SPARE1_LED: J7.17
SPARE2_LED: J7.16
~{WATCHDOG_RESET}: J10.15
WAKE_SAT: J9.27
WATCHDOG_WARN: J10.12

Not connected (* = marked no-connect by the designer): J7 MP1 MP2; J8 MP1 MP2; J9 MP1 MP2; J10 MP1 MP2

### Notes on the sheet
- Title
- Drawn By:
- Date:
- Time:
- Revision:
- Sheet
- of
- The Latium Group of Companies
- 1312 10 Street
- Nisku, Alberta
- T9E 8K2
- Canada
- File:
- (in symbol SMD M3 Spacer) StdOff
- (in symbol TS-4900 Daughterboard) Latium Technologies

### Library data of the parts
H12-H15 = SMD M3 Spacer: as H1 on sheet Concentrator and Cell Modem Headers; Supplier 1: Digi-Key; Value: 9774030243R; Manufacturer Part Number: 9774030243R; ComponentLink1Description: Drawing; ComponentLink1URL: S:\Hardware\Data Sheets\Passive\Standoffs\Wurth 9774070360R.pdf; Supplier 1 Part Number: 732-7085-1-ND
J7-J10 = Amphenol 30 Pos BergStak Plug: as J1 on sheet Concentrator and Cell Modem Headers; Value: 30 Pin SMD Receptacle; Manufacturer Part Number: 10132798-031100LF; Supplier 1: Digi-Key; Supplier 1 Part Number: 609-5030-1-ND
U7 = TS-4900 Daughterboard: Value: TS-4900 Daughterboard

## Sheet Controller Watchdog.SchDoc: Modular Parent Motherboard
size Letter; DrawnBy: MTAN; Organization: Altium Limited; DocumentNumber: 6; Revision: B; SheetNumber: 6; SheetTotal: 6
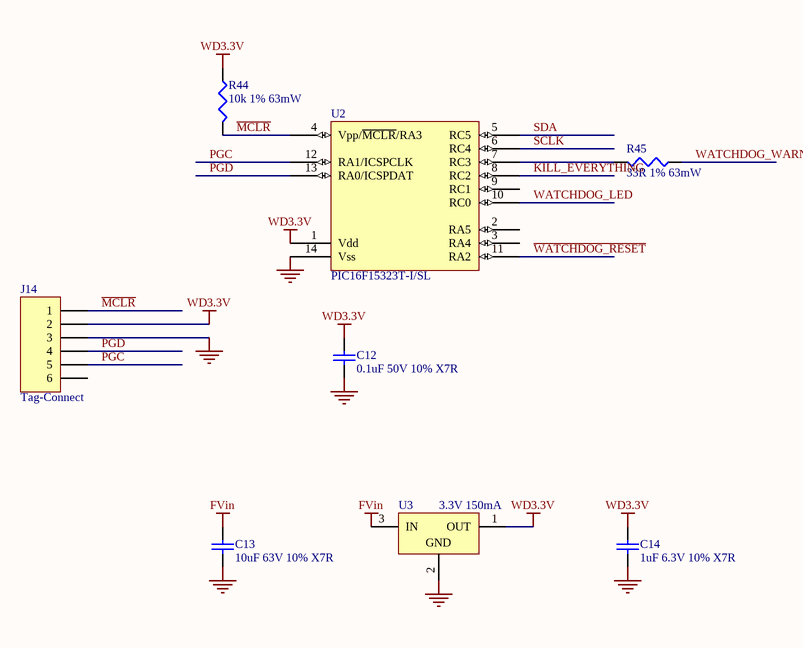
[diagram p5: Controller Watchdog.SchDoc]

### Parts
C12  0.1uF 50V 10% X7R  [CAPC1005L]
C13  10uF 63V 10% X7R  [C1210_L]
C14  1uF 6.3V 10% X7R  [CAPC1005L]
J14  Tag-Connect  [TC2030-MCP]
R44  10k 1% 63mW  [RESC1005L]
R45  33R 1% 63mW  [RESC1005L]
U2  PIC16F15323T-I/SL  [14SOP_L]
U3  3.3V 150mA  [SOT89L]

### Nets
FVin: C13.2 U3.3(IN)
GND: C12.2 C13.1 C14.2 J14.3 U2.14(Vss) U3.2(GND)
WD3.3V: C12.1 C14.1 J14.2 R44.1 U2.1(Vdd) U3.1(OUT)
KILL_EVERYTHING: U2.8(RC2)
~{MCLR}: J14.1 R44.2 U2.4(Vpp/~{MCLR}/RA3)
PGC: J14.5 U2.12(RA1/ICSPCLK)
PGD: J14.4 U2.13(RA0/ICSPDAT)
SCLK: U2.6(RC4)
SDA: U2.5(RC5)
~{WATCHDOG_RESET}: U2.11(RA2)
WATCHDOG_LED: U2.10(RC0)
WATCHDOG_WARN: R45.2
NetR45_1: R45.1 U2.7(RC3)

Not connected (* = marked no-connect by the designer): J14 6; U2 2(RA5) 3(RA4) 9(RC1)

### Notes on the sheet
- Title
- Drawn By:
- Date:
- Time:
- Revision:
- Sheet
- of
- The Latium Group of Companies
- 1312 10 Street
- Nisku, Alberta
- T9E 8K2
- Canada
- File:

### Library data of the parts
C12-C14 = Cap: Capacitor
  C12: Value: 0.1uF 50V 10% X7R
  C13: Value: 10uF 63V 10% X7R
  C14: Value: 1uF 6.3V 10% X7R
J14 = Header 6: Tag Connect Programming Header; Value: Tag-Connect
R44 R45 = Res3: Resistor
  R44: Value: 10k 1% 63mW
  R45: Value: 33R 1% 63mW
U2 = PIC16F15323: IC MCU 8BIT 3.5KB FLASH 14SOIC; Manufacturer: Microchip Technology; Value: PIC16F15323T-I/SL; Manufacturer Part Number: PIC16F15323T-I/SL; Supplier 1: Digi-Key; Supplier 1 Part Number: PIC16F15323T-I/SLCT-ND
U3 = LP2954AIT: IC REG LINEAR 3.3V 150MA SOT89; Manufacturer Part Number: AP7381-33Y-13; Manufacturer: Diodes Incorporated; Value: 3.3V 150mA; Supplier 1: Digi-Key; Supplier 1 Part Number: AP7381-33Y-13DICT-ND

## Nets that join several sheets
3.3V: Concentrator and Cell Modem Headers (5 pins), Expansion Headers (J11.1 J11.29 J11.30), Slot Pullups and Pulldowns (7 pins), Power Supply and LEDs (R9.2 R14.2 R15.2), Controller Headers (J9.1 J9.2)
5V: Concentrator and Cell Modem Headers (16 pins), Expansion Headers (J12.1 J12.2 J12.3 J12.4), Power Supply and LEDs (16 pins), Controller Headers (6 pins)
FVin: Power Supply and LEDs (5 pins), Controller Watchdog (C13.2 U3.3)
GND: Concentrator and Cell Modem Headers (102 pins), Expansion Headers (37 pins), Slot Pullups and Pulldowns (21 pins), Power Supply and LEDs (28 pins), Controller Headers (50 pins), Controller Watchdog (6 pins)
Modem3.8V: Concentrator and Cell Modem Headers (J5.30), Controller Headers (J10.14)
PVin: Concentrator and Cell Modem Headers (12 pins), Power Supply and LEDs (8 pins), Controller Headers (J7.30)
SAT_Vcc: Concentrator and Cell Modem Headers (J6.7), Controller Headers (J9.19)
WD3.3V: Power Supply and LEDs (R43.1), Controller Watchdog (6 pins)
~{CELL_1.8V_GOOD}: Concentrator and Cell Modem Headers (J5.15), Controller Headers (J10.13)
~{CELL_WAKE_HOST}: Concentrator and Cell Modem Headers (J5.23), Slot Pullups and Pulldowns (R23.1), Controller Headers (J10.4)
~{CONTROLLER_GREEN_LED}: Power Supply and LEDs (D7.2), Controller Headers (J7.26)
~{CONTROLLER_RED_LED}: Power Supply and LEDs (D6.2), Controller Headers (J7.27)
CELL_ACTIVITY_LED: Power Supply and LEDs (Q3.1), Controller Headers (J7.19)
CELL_CTS: Concentrator and Cell Modem Headers (J5.3), Slot Pullups and Pulldowns (R26.2), Controller Headers (J10.8)
CELL_DTR: Concentrator and Cell Modem Headers (J5.2), Slot Pullups and Pulldowns (R32.2), Controller Headers (J10.7)
CELL_PRESENT: Concentrator and Cell Modem Headers (J2.2 R2.2), Controller Headers (J10.1)
CELL_RI: Concentrator and Cell Modem Headers (J5.1), Slot Pullups and Pulldowns (R31.2), Controller Headers (J10.6)
CELL_RTS: Concentrator and Cell Modem Headers (J5.4), Slot Pullups and Pulldowns (R27.2), Controller Headers (J10.9)
CELL_USB_DM: Concentrator and Cell Modem Headers (J5.27), Slot Pullups and Pulldowns (D13.2), Controller Headers (J10.3)
CELL_USB_DP: Concentrator and Cell Modem Headers (J5.26), Slot Pullups and Pulldowns (D12.2), Controller Headers (J10.2)
DBG_HOSTRX_SATTX: Concentrator and Cell Modem Headers (J6.18), Controller Headers (J9.23)
DBG_HOSTTX_SATRX: Concentrator and Cell Modem Headers (J6.19), Controller Headers (J9.24)
~{EXP_CS}: Expansion Headers (J12.27), Slot Pullups and Pulldowns (R37.1), Controller Headers (J9.12)
EXP_PRESENT: Expansion Headers (J11.2 R4.2), Controller Headers (J9.15)
EXP_RESET: Expansion Headers (J12.19), Slot Pullups and Pulldowns (R41.2), Controller Headers (J9.8)
EXP_SPI_CLK: Expansion Headers (J12.21), Slot Pullups and Pulldowns (R40.2), Controller Headers (J9.9)
EXP_SPI_MISO: Expansion Headers (J12.25), Slot Pullups and Pulldowns (R38.2), Controller Headers (J9.11)
EXP_SPI_MOSI: Expansion Headers (J12.23), Slot Pullups and Pulldowns (R39.2), Controller Headers (J9.10)
EXP_USB_DM: Expansion Headers (J11.25), Slot Pullups and Pulldowns (D17.2), Controller Headers (J9.14)
EXP_USB_DP: Expansion Headers (J11.26), Slot Pullups and Pulldowns (D16.2), Controller Headers (J9.13)
GPS_1PPS: Concentrator and Cell Modem Headers (J4.17 J6.24), Slot Pullups and Pulldowns (R22.2), Controller Headers (J7.25)
HEARTBEAT_LED: Power Supply and LEDs (Q4.1), Controller Headers (J7.21)
HOSTRX_CELLTX: Concentrator and Cell Modem Headers (J5.6), Controller Headers (J10.11)
HOSTRX_EXPTX: Expansion Headers (J12.16), Controller Headers (J9.7)
HOSTRX_SATTX: Concentrator and Cell Modem Headers (J6.16), Controller Headers (J9.21)
HOSTTX_CELLRX: Concentrator and Cell Modem Headers (J5.5), Controller Headers (J10.10)
HOSTTX_EXPRX: Expansion Headers (J12.17), Controller Headers (J9.6)
HOSTTX_SATRX: Concentrator and Cell Modem Headers (J6.17), Controller Headers (J9.22)
KILL_EVERYTHING: Power Supply and LEDs (Q9.1), Controller Watchdog (U2.8)
~{LORA_CS}: Concentrator and Cell Modem Headers (J4.27), Slot Pullups and Pulldowns (R30.1), Controller Headers (J8.22)
LORA_ACTIVITY_LED: Power Supply and LEDs (Q2.1), Controller Headers (J7.20)
LORA_EXP1: Concentrator and Cell Modem Headers (J1.27), Controller Headers (J8.29)
LORA_EXP2: Concentrator and Cell Modem Headers (J1.26), Controller Headers (J8.28)
LORA_EXP3: Concentrator and Cell Modem Headers (J1.25), Controller Headers (J8.27)
LORA_EXP4: Concentrator and Cell Modem Headers (J1.24), Controller Headers (J8.26)
LORA_EXP5: Concentrator and Cell Modem Headers (J1.23), Controller Headers (J8.25)
LORA_EXP6: Concentrator and Cell Modem Headers (J1.22), Controller Headers (J8.24)
LORA_EXP7: Concentrator and Cell Modem Headers (J1.21), Controller Headers (J8.23)
LORA_PRESENT: Concentrator and Cell Modem Headers (J1.2 R1.2), Controller Headers (J8.30)
LORA_RESET: Concentrator and Cell Modem Headers (J4.19), Slot Pullups and Pulldowns (R36.2), Controller Headers (J8.18)
LORA_SPI_CLK: Concentrator and Cell Modem Headers (J4.21), Slot Pullups and Pulldowns (R35.2), Controller Headers (J8.19)
LORA_SPI_MISO: Concentrator and Cell Modem Headers (J4.25), Slot Pullups and Pulldowns (R33.2), Controller Headers (J8.21)
LORA_SPI_MOSI: Concentrator and Cell Modem Headers (J4.23), Slot Pullups and Pulldowns (R34.2), Controller Headers (J8.20)
RESET_CELL: Concentrator and Cell Modem Headers (J5.22), Slot Pullups and Pulldowns (R24.1), Controller Headers (J10.5)
RESET_SAT: Concentrator and Cell Modem Headers (J6.22), Slot Pullups and Pulldowns (R25.1), Controller Headers (J9.26)
~{SAT_1.8V_GOOD}: Concentrator and Cell Modem Headers (J6.8), Controller Headers (J9.20)
~{SINK_CELL_LED}: Concentrator and Cell Modem Headers (J5.24), Power Supply and LEDs (D3.2)
SAT_ACTIVITY_LED: Power Supply and LEDs (Q7.1), Controller Headers (J7.18)
SAT_COMM_POSSIBLE: Concentrator and Cell Modem Headers (J6.21), Slot Pullups and Pulldowns (R29.2), Controller Headers (J9.25)
SAT_PRESENT: Concentrator and Cell Modem Headers (J3.2 R3.2), Controller Headers (J9.30)
SAT_USB_DM: Concentrator and Cell Modem Headers (J6.26), Slot Pullups and Pulldowns (D15.2), Controller Headers (J9.28)
SAT_USB_DP: Concentrator and Cell Modem Headers (J6.27), Slot Pullups and Pulldowns (D14.2), Controller Headers (J9.29)
SCLK: Concentrator and Cell Modem Headers (J1.4 J2.4 J3.4), Expansion Headers (J11.4), Slot Pullups and Pulldowns (R21.1), Controller Headers (J7.28), Controller Watchdog (U2.6)
SDA: Concentrator and Cell Modem Headers (J1.3 J2.3 J3.3), Expansion Headers (J11.3), Slot Pullups and Pulldowns (R20.1), Controller Headers (J7.29), Controller Watchdog (U2.5)
SPARE1_LED: Power Supply and LEDs (Q6.1), Controller Headers (J7.17)
SPARE2_LED: Power Supply and LEDs (Q5.1), Controller Headers (J7.16)
~{WATCHDOG_RESET}: Controller Headers (J10.15), Controller Watchdog (U2.11)
WAKE_SAT: Concentrator and Cell Modem Headers (J6.23), Slot Pullups and Pulldowns (R28.2), Controller Headers (J9.27)
WATCHDOG_LED: Power Supply and LEDs (Q10.1), Controller Watchdog (U2.10)
WATCHDOG_WARN: Controller Headers (J10.12), Controller Watchdog (R45.2)